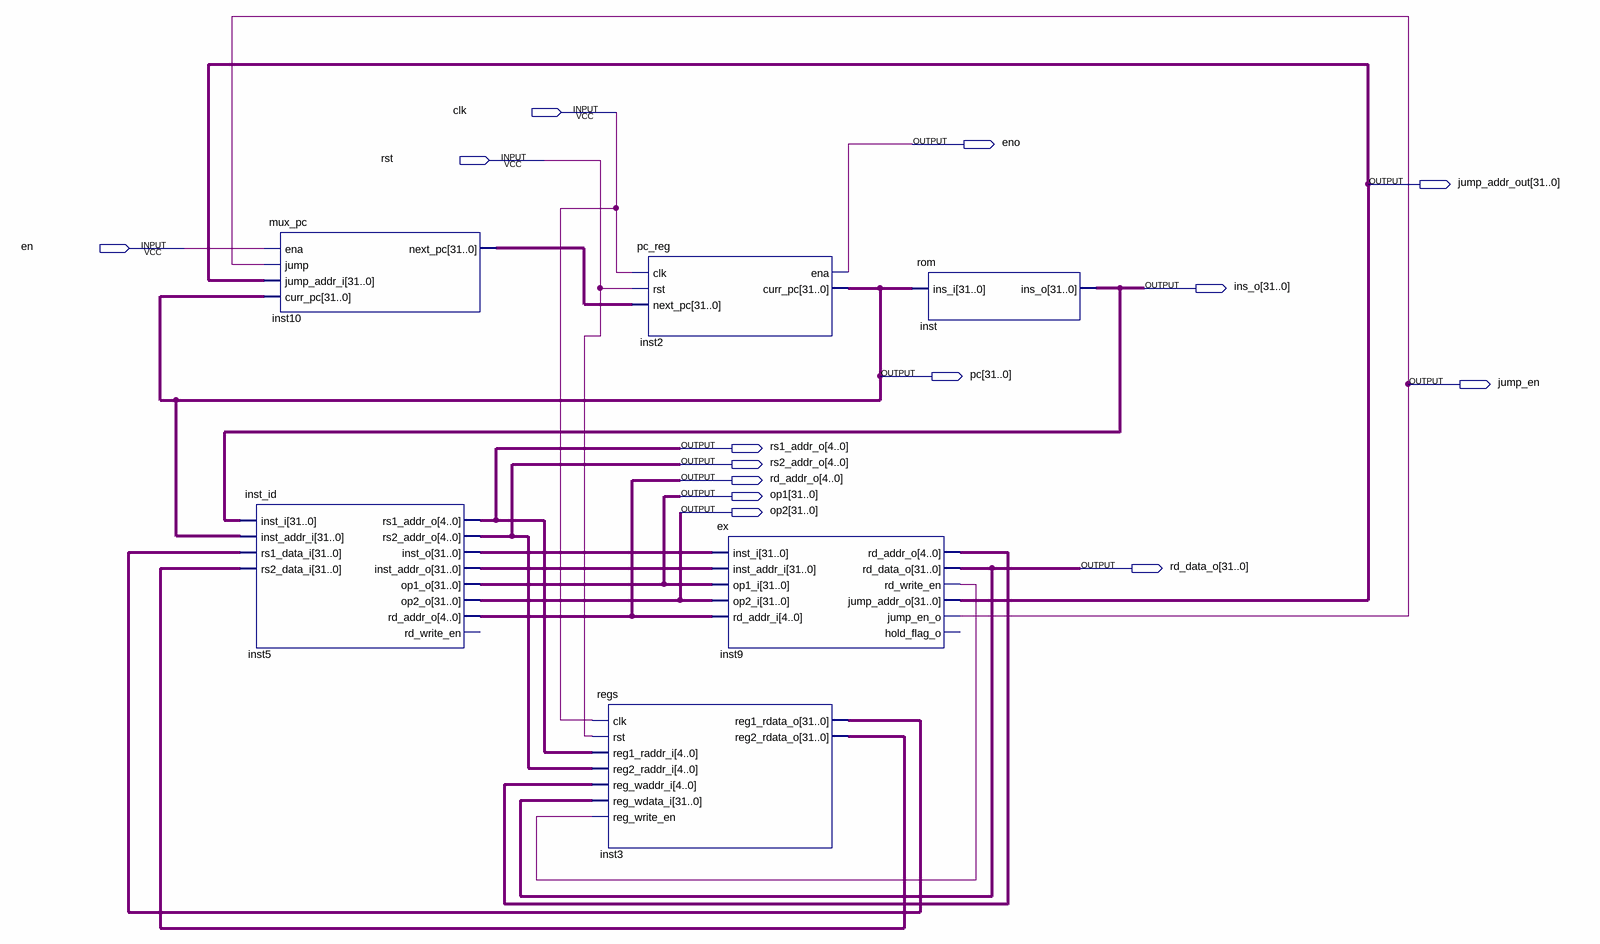
[diagram p0: schematic sheet]
// Quartus schematic RISC.bdf as structural Verilog: 6 symbols, 14 pins
module RISC (
  input  clk,
  input  rst,
  input  en,
  output eno,
  output [31:0] jump_addr_out,
  output [31:0] ins_o,
  output [31:0] pc,
  output jump_en,
  output [4:0] rs1_addr_o,
  output [4:0] rs2_addr_o,
  output [4:0] rd_addr_o,
  output [31:0] op1,
  output [31:0] op2,
  output [31:0] rd_data_o
);

  wire inst9_rd_write_en;
  wire [4:0] inst9_rd_addr_o;
  wire [31:0] inst3_reg1_rdata_o, inst3_reg2_rdata_o, inst5_inst_addr_o, inst5_inst_o, inst10_next_pc;

  mux_pc inst10 (.ena(en), .jump(jump_en), .jump_addr_i(jump_addr_out), .curr_pc(pc), .next_pc(inst10_next_pc));
  inst_id inst5 (
    .inst_i(ins_o), .inst_addr_i(pc), .rs1_data_i(inst3_reg1_rdata_o), .rs2_data_i(inst3_reg2_rdata_o),
    .rs1_addr_o(rs1_addr_o), .rs2_addr_o(rs2_addr_o), .inst_o(inst5_inst_o), .inst_addr_o(inst5_inst_addr_o),
    .op1_o(op1), .op2_o(op2), .rd_addr_o(rd_addr_o));  // open: rd_write_en
  pc_reg inst2 (.clk(clk), .rst(rst), .next_pc(inst10_next_pc), .ena(eno), .curr_pc(pc));
  regs inst3 (
    .clk(clk), .rst(rst), .reg1_raddr_i(rs1_addr_o), .reg2_raddr_i(rs2_addr_o),
    .reg_waddr_i(inst9_rd_addr_o), .reg_wdata_i(rd_data_o), .reg_write_en(inst9_rd_write_en),
    .reg1_rdata_o(inst3_reg1_rdata_o), .reg2_rdata_o(inst3_reg2_rdata_o));
  ex inst9 (
    .inst_i(inst5_inst_o), .inst_addr_i(inst5_inst_addr_o), .op1_i(op1), .op2_i(op2), .rd_addr_i(rd_addr_o),
    .rd_addr_o(inst9_rd_addr_o), .rd_data_o(rd_data_o), .rd_write_en(inst9_rd_write_en),
    .jump_addr_o(jump_addr_out), .jump_en_o(jump_en));  // open: hold_flag_o
  rom inst (.ins_i(pc), .ins_o(ins_o));
endmodule
